# EAGLE design OPA188 (EAGLE 6.5.0)

## Sheet 1 of 2

## Sheet 2 of 2
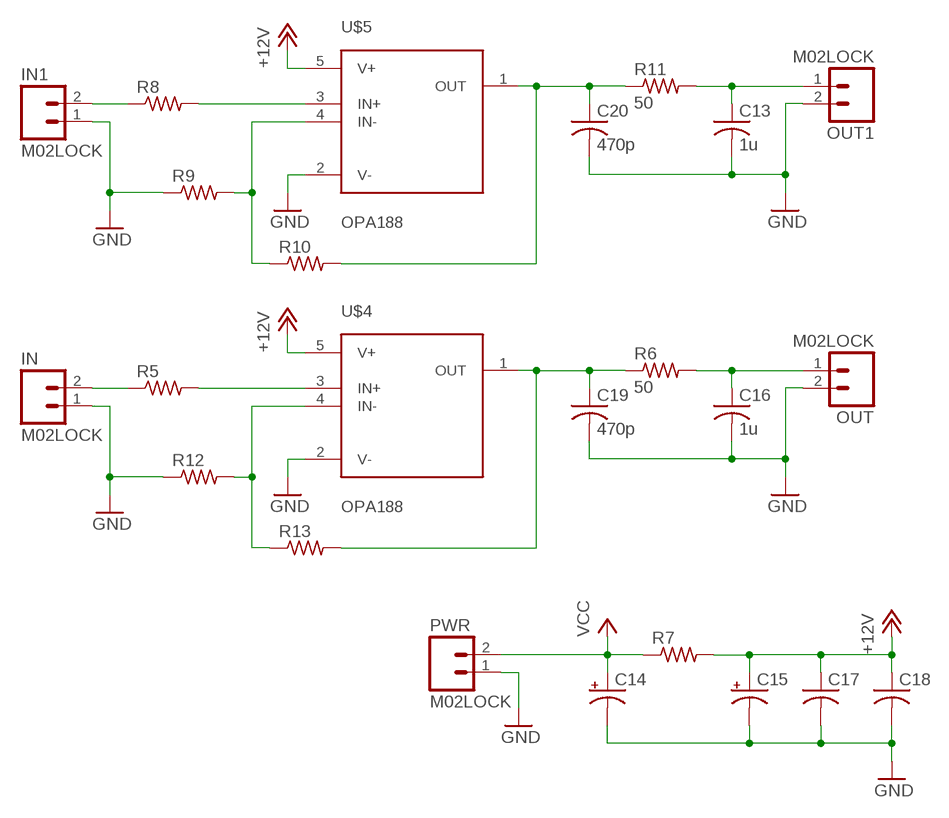
[diagram p0: schematic, sheet 2]

### Parts
C13  1u  C-USC0805  [C0805]
C14  CPOL-US  [SMD_6.6X6.6]
C15  CPOL-US  [SMD_6.6X6.6]
C16  1u  C-USC0805  [C0805]
C17  C-USC0805  [C0805]
C18  C-USC0805  [C0805]
C19  470p  C-USC0805  [C0805]
C20  470p  C-USC0805  [C0805]
IN  M02LOCK  [1X02_LOCK]
IN1  M02LOCK  [1X02_LOCK]
OUT  M02LOCK  [1X02_LOCK]
OUT1  M02LOCK  [1X02_LOCK]
PWR  M02LOCK  [1X02_LOCK]
R5  R-US_R0805  [R0805]
R6  50  R-US_R0805  [R0805]
R7  R-US_R1206  [R1206]
R8  R-US_R0805  [R0805]
R9  R-US_R0805  [R0805]
R10  R-US_R0805  [R0805]
R11  50  R-US_R0805  [R0805]
R12  R-US_R0805  [R0805]
R13  R-US_R0805  [R0805]
U$4  OPA188  [SOT23-DBV]
U$5  OPA188  [SOT23-DBV]

### Nets
+12V: C15.+ C17.1 C18.1 R7.2 U$4.5(V+) U$5.5(V+)
GND: C13.2 C14.- C15.- C16.2 C17.2 C18.2 C19.2 C20.2 IN1.1 IN.1 OUT1.2 OUT.2 PWR.1 R9.1 R12.1 U$4.2(V-) U$5.2(V-)
N$1: C16.1 OUT.1 R6.2
N$2: IN1.2 R8.1
N$3: IN.2 R5.1
N$4: R5.2 U$4.3(IN+)
N$8: R8.2 U$5.3(IN+)
N$9: R12.2 R13.1 U$4.4(IN-)
N$10: C19.1 R6.1 R13.2 U$4.1(OUT)
N$11: R9.2 R10.1 U$5.4(IN-)
N$12: C20.1 R10.2 R11.1 U$5.1(OUT)
N$13: C13.1 OUT1.1 R11.2
VCC: C14.+ PWR.2 R7.1

## Library data of the parts
C13 C16-C20 = rcl:C-US: CAPACITOR, American symbol
C14 C15 = rcl:CPOL-US: POLARIZED CAPACITOR, American symbol
IN IN1 OUT OUT1 PWR = SparkFun-Connectors:M02: Standard 2-pin 0.1" header. Use with - straight break away headers ( PRT-00116) - right angle break away headers (PRT-00553) - swiss pins (PRT-00743) - machine pins (PRT-00117) - female headers (PRT-00115) Molex polarized connector foot print use with: PRT-08233 with associated crimp pins and housings. 2.54_SCREWTERM for use with PRT-10571. 3.5mm Screw Terminal footprints for PRT-08084 5mm Screw Terminal footprints for use with PRT-08432
R5-R13 = rcl:R-US_: RESISTOR, American symbol
U$4 U$5 = texas:OPA188

## Board
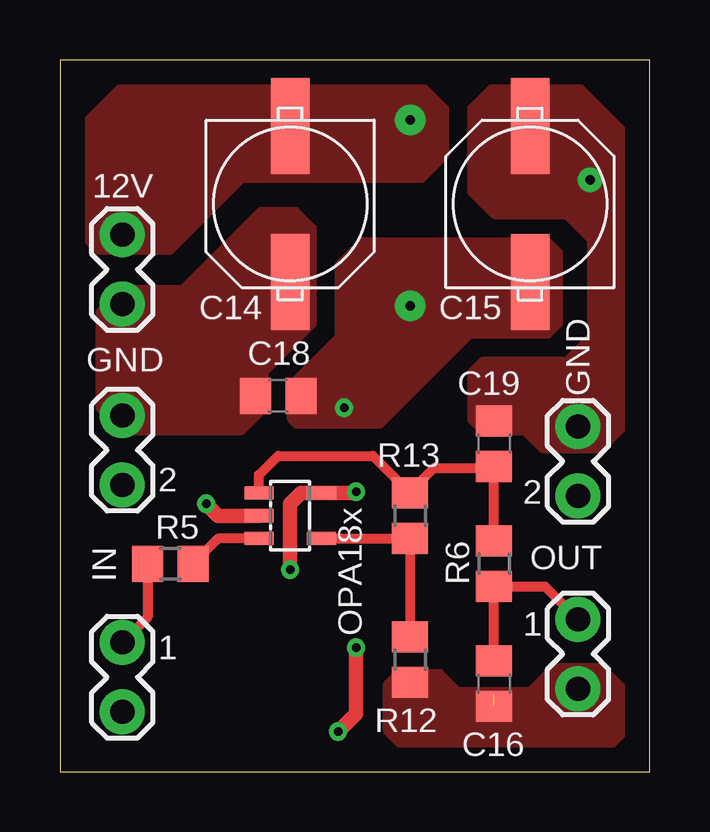
[diagram p1: board, top side]
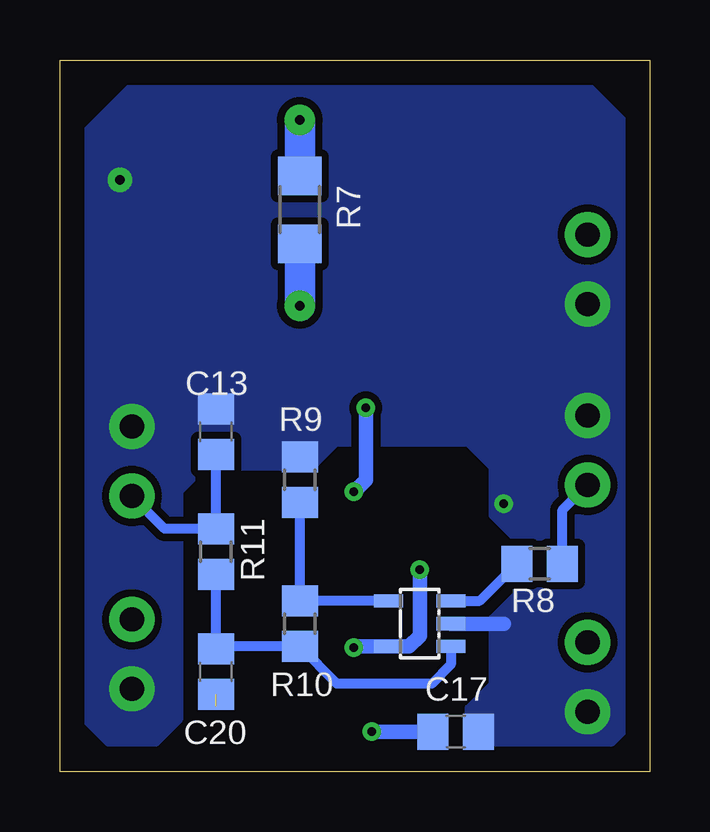
[diagram p2: board, bottom side, seen from below]

Size 24.6 x 29.68 mm. Coordinates in mm from the lower left corner, seen from the top.
Outline: 0,0 24.6,0 24.6,29.68 0,29.68 0,0
Copper layers (1*16): Top 0.035mm / dielectric 1.5mm / Bottom 0.035mm
Design rules "default": minimum track width 10mil, minimum drill 24mil, track to track 8mil, track to pad 8mil, pad to pad 8mil, via to via 8mil, smd to smd 8mil, copper to edge 40mil, drill to drill 8mil, minimum pad ring 10mil, minimum via ring 8mil, stop-mask expansion 4mil, vias tented up to drill 0mil, thermal gap 10mil

### Footprints (pad centres in the part's own frame; a part is rotated, then mirrored left to right if it is on the bottom)
C0805 = smd 1.3 x 1.5: 1 -0.95,0; 2 0.95,0
SMD_6.6X6.6 = smd 4 x 1.6: + -3.25,0; - 3.25,0
1X02_LOCK = drill 1.016 pad 1.88: 1 -0.178,0; 2 2.718,0
R0805 = smd 1.3 x 1.5: 1 -0.95,0; 2 0.95,0
R1206 = smd 1.6 x 1.803: 1 -1.422,0; 2 1.422,0
SOT23-DBV = smd 0.55 x 1.2: 1 -0.95,-1.3; 2 0,-1.3; 3 0.95,-1.3; 4 0.95,1.3; 5 -0.95,1.3

### Placement (x,y rotation side)
C13  18.1,14.18 90 bottom
C14  9.6,23.68 270 top
C15  19.6,23.68 90 top
C16  18.1,3.68 270 top
C17  8.1,1.68 0 bottom
C18  9.1,15.68 180 top
C19  18.1,13.68 90 top
C20  18.1,4.18 270 bottom
IN  2.6,2.68 90 top
IN1  2.6,14.68 270 top
OUT  21.6,6.18 270 top
OUT1  21.6,11.68 90 top
PWR  2.6,19.68 90 top
R5  4.6,8.68 0 top
R6  18.1,8.68 270 top
R7  14.6,23.43 270 bottom
R8  4.6,8.68 180 bottom
R9  14.6,12.18 270 bottom
R10  14.6,6.18 270 bottom
R11  18.1,9.18 90 bottom
R12  14.6,4.68 90 top
R13  14.6,10.68 90 top
U$4  9.6,10.68 270 top
U$5  9.6,6.18 90 bottom

### Tracks (layer width: path | path; a pad name or v marks a point on that pad's centre or on a via)
+12V  (via drill 0.35, 0.4 pad 1.27)
  Top 0.61: v9.6,8.43 9.6,11.18 10.05,11.63 U$4.5 12.35,11.63 v12.35,11.68 | v11.6,1.68 12.35,2.43 v12.35,5.18
  Bottom 0.61: v9.6,8.43 9.6,5.68 10.05,5.23 U$5.5 12.35,5.23 v12.35,5.18 | v11.85,15.18 11.85,12.18 v12.35,11.68 | C17.1 v11.6,1.68
  Bottom 1.27: R7.2 v14.6,19.43
  pour Top (isolate 0.305, no thermals): 20.35,22.18 20.85,21.68 20.85,18.68 20.35,18.18 17.1,18.18 13.35,14.43 9.85,14.43 9.6,14.68 9.6,16.18 11.6,18.18 11.6,21.18 12.6,22.18
GND  (via drill 0.35, 0.4 pad 1.02)  (1 unrouted)
  Top 0.61: U$4.2 6.6,10.68 v6.1,11.18
  Bottom 0.61: U$5.2 6.1,6.18
  other vias: 22.1,24.68
  pour Bottom (isolate 0.305, no thermals): 21.6,28.68 2.6,28.68 0.6,26.68 0.6,2.18 1.6,1.18 7.6,1.18 7.6,2.68 6.6,3.68 6.6,6.43 5.6,7.43 5.6,9.68 6.6,10.68 6.6,12.68 7.6,13.68 13.1,13.68 14.1,12.68 18.6,12.68 19.6,11.68 19.6,2.18 20.6,1.18 22.6,1.18 23.6,2.18 23.6,26.68
  pour Top (isolate 0.305, no thermals): 9.85,23.43 8.35,23.43 5.1,20.18 2.6,20.18 1.6,19.18 1.6,15.18 2.6,14.18 7.6,14.18 8.6,15.18 8.6,16.68 10.6,18.68 10.6,22.68
  pour Top (isolate 0.305, no thermals): 23.6,26.68 21.6,28.68 18.1,28.68 17.1,27.68 17.1,24.18 18.1,23.18 21.1,23.18 22.1,22.18 22.1,18.18 21.1,17.18 17.6,17.18 17.1,16.68 17.1,14.68 17.6,14.18 19.35,14.18 20.1,13.43 22.6,13.43 23.6,14.43
  pour Top (isolate 0.305, no thermals): 22.6,4.43 23.6,3.43 23.6,1.68 22.6,0.68 14.6,0.68 13.6,1.68 13.6,3.68 14.1,4.18 15.85,4.18 16.6,3.43 19.6,3.43 20.6,4.43
N$1
  Top 0.406: C16.1 R6.2 20.23,7.73 OUT.1
N$2
  Bottom 0.406: R8.1 3.65,10.91 IN1.2
N$3
  Top 0.406: R5.1 3.65,6.45 IN.2
N$4
  Top 0.406: U$4.3 6.6,9.73 R5.2
N$8
  Bottom 0.406: U$5.3 7.1,7.13 R8.2
N$9
  Top 0.406: U$4.4 R13.1 R12.2
N$10
  Top 0.406: U$4.1 8.3,12.38 9.1,13.18 13.05,13.18 R13.2 14.6,11.68 15.6,12.68 18.05,12.68 C19.1 R6.1
N$11
  Bottom 0.406: U$5.4 R10.1 R9.2
N$12
  Bottom 0.406: U$5.1 8.3,4.48 9.1,3.68 13.05,3.68 R10.2 18,5.23 C20.1 R11.1
N$13
  Bottom 0.406: C13.1 R11.2 20.23,10.13 OUT1.1
VCC  (via drill 0.4 pad 1.27)
  Bottom 1.27: R7.1 v14.6,27.18
  pour Top (isolate 0.305, no thermals): 15.1,28.68 16.1,27.68 16.1,25.68 15.1,24.68 7.6,24.68 4.6,21.68 1.6,21.68 0.6,22.68 0.6,26.68 2.6,28.68

### Text on the board
tPlace: 12V | GND | GND | 2 | 2 | IN | OUT | 1 | OPA18x | 1